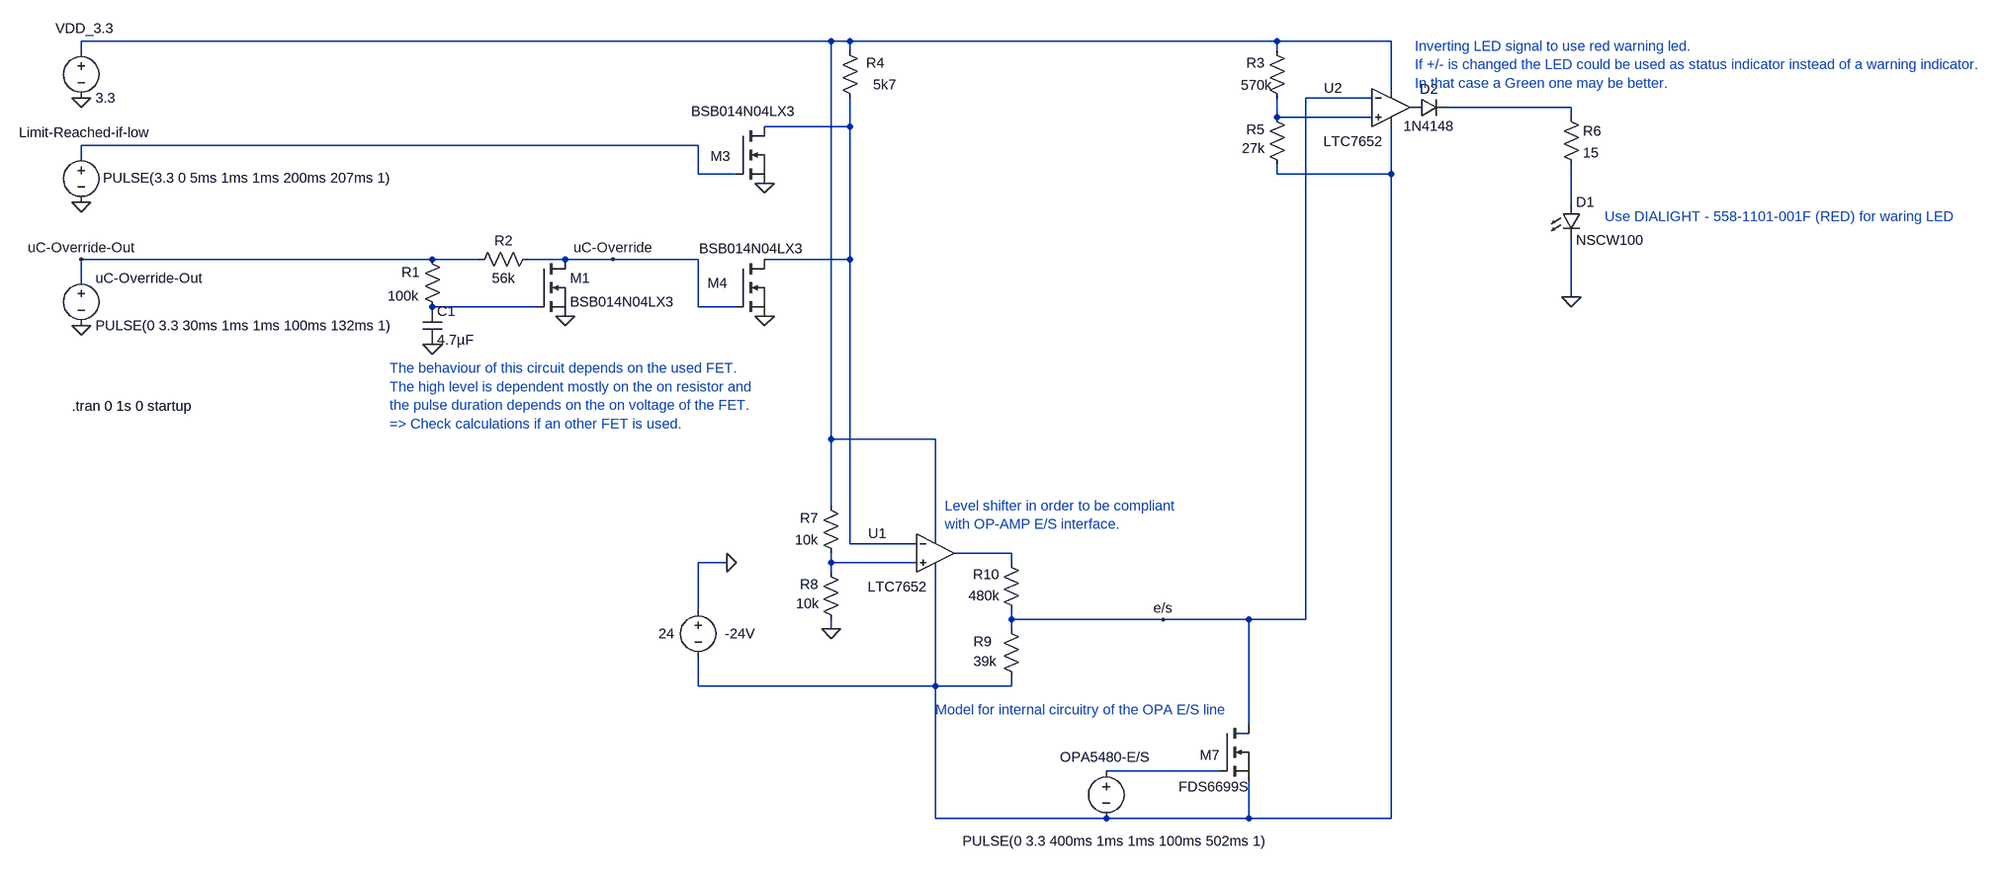
[diagram p0: schematic LimitSwitchOverrider.asc]
LimitSwitchOverrider.asc, the LTspice schematic file:
Version 4
SHEET 1 3236 1280
WIRE 544 -304 -720 -304
WIRE 576 -304 544 -304
WIRE 1296 -304 576 -304
WIRE 1488 -304 1296 -304
WIRE -720 -288 -720 -304
WIRE 576 -288 576 -304
WIRE 1296 -288 1296 -304
WIRE 1488 -224 1488 -304
WIRE 1456 -208 1344 -208
WIRE 1792 -192 1584 -192
WIRE 1296 -176 1296 -208
WIRE 1456 -176 1296 -176
WIRE 1792 -176 1792 -192
WIRE 576 -160 576 -208
WIRE 576 -160 432 -160
WIRE 320 -128 -720 -128
WIRE -720 -112 -720 -128
WIRE 320 -80 320 -128
WIRE 384 -80 320 -80
WIRE 1296 -80 1296 -96
WIRE 1488 -80 1488 -160
WIRE 1488 -80 1296 -80
WIRE 1792 -32 1792 -96
WIRE -128 64 -720 64
WIRE -48 64 -128 64
WIRE 96 64 32 64
WIRE 176 64 96 64
WIRE 320 64 176 64
WIRE 576 64 576 -160
WIRE 576 64 432 64
WIRE -720 96 -720 64
WIRE 1792 128 1792 32
WIRE 48 144 -128 144
WIRE 320 144 320 64
WIRE 384 144 320 144
WIRE 544 368 544 -304
WIRE 720 368 544 368
WIRE 544 480 544 368
WIRE 720 528 720 368
WIRE 576 544 576 64
WIRE 688 544 576 544
WIRE 848 560 752 560
WIRE 368 576 320 576
WIRE 544 576 544 560
WIRE 688 576 544 576
WIRE 848 576 848 560
WIRE 544 592 544 576
WIRE 320 656 320 576
WIRE 848 672 848 656
WIRE 1104 672 848 672
WIRE 1248 672 1104 672
WIRE 1344 672 1344 -208
WIRE 1344 672 1248 672
WIRE 544 688 544 672
WIRE 848 688 848 672
WIRE 320 784 320 736
WIRE 720 784 720 592
WIRE 720 784 320 784
WIRE 848 784 848 768
WIRE 848 784 720 784
WIRE 1248 848 1248 672
WIRE 1200 928 1008 928
WIRE 720 1008 720 784
WIRE 1008 1008 720 1008
WIRE 1248 1008 1248 944
WIRE 1248 1008 1008 1008
WIRE 1488 1008 1488 -80
WIRE 1488 1008 1248 1008
FLAG -128 208 0
FLAG -720 176 0
FLAG 176 64 uC-Override
FLAG -720 64 uC-Override-Out
FLAG -720 -32 0
FLAG -720 -208 0
FLAG 368 576 0
FLAG 544 688 0
FLAG 96 160 0
FLAG 432 -64 0
FLAG 432 160 0
FLAG 1104 672 e/s
FLAG 1792 128 0
SYMBOL res -144 48 R0
WINDOW 0 -36 38 Left 2
WINDOW 3 -59 78 Left 2
SYMATTR InstName R1
SYMATTR Value 100k
SYMBOL voltage -720 80 R0
WINDOW 123 0 0 Left 2
WINDOW 39 0 0 Left 2
SYMATTR InstName uC-Override-Out
SYMATTR Value PULSE(0 3.3 30ms 1ms 1ms 100ms 132ms 1)
SYMBOL cap -144 144 R0
SYMATTR InstName C1
SYMATTR Value 4.7µF
SYMBOL res 48 48 R90
WINDOW 0 0 56 VBottom 2
WINDOW 3 32 56 VTop 2
SYMATTR InstName R2
SYMATTR Value 56k
SYMBOL voltage -720 -128 R0
WINDOW 0 -105 -22 Left 2
WINDOW 3 37 55 Left 2
WINDOW 123 0 0 Left 2
WINDOW 39 0 0 Left 2
SYMATTR InstName Limit-Reached-if-low
SYMATTR Value PULSE(3.3 0 5ms 1ms 1ms 200ms 207ms 1)
SYMBOL voltage -720 -304 R0
WINDOW 0 -43 -22 Left 2
WINDOW 123 0 0 Left 2
WINDOW 39 0 0 Left 2
SYMATTR InstName VDD_3.3
SYMATTR Value 3.3
SYMBOL voltage 320 640 R0
WINDOW 0 45 56 Left 2
WINDOW 3 -67 56 Left 2
WINDOW 123 0 0 Left 2
WINDOW 39 0 0 Left 2
SYMATTR InstName -24V
SYMATTR Value 24
SYMBOL Opamps\\LTC7652 720 496 R0
WINDOW 0 -113 31 Left 2
WINDOW 3 -114 121 Left 2
SYMATTR InstName U1
SYMBOL res 528 464 R0
WINDOW 0 -36 37 Left 2
WINDOW 3 -45 74 Left 2
SYMATTR InstName R7
SYMATTR Value 10k
SYMBOL res 528 576 R0
WINDOW 0 -36 37 Left 2
WINDOW 3 -43 69 Left 2
SYMATTR InstName R8
SYMATTR Value 10k
SYMBOL nmos 384 -160 R0
WINDOW 0 -43 50 Left 2
WINDOW 3 -76 -26 Left 2
SYMATTR InstName M3
SYMATTR Value BSB014N04LX3
SYMBOL res 592 -192 R180
WINDOW 0 -42 75 Left 2
WINDOW 3 -62 39 Left 2
SYMATTR InstName R4
SYMATTR Value 5k7
SYMBOL nmos 384 64 R0
WINDOW 0 -48 40 Left 2
WINDOW 3 -62 -18 Left 2
SYMATTR InstName M4
SYMATTR Value BSB014N04LX3
SYMBOL res 832 672 R0
WINDOW 0 -48 37 Left 2
WINDOW 3 -48 71 Left 2
SYMATTR InstName R9
SYMATTR Value 39k
SYMBOL res 864 672 R180
WINDOW 0 36 76 Left 2
WINDOW 3 36 40 Left 2
SYMATTR InstName R10
SYMATTR Value 480k
SYMBOL voltage 1008 912 R0
WINDOW 0 -78 -8 Left 2
WINDOW 3 -242 134 Left 2
WINDOW 123 0 0 Left 2
WINDOW 39 0 0 Left 2
SYMATTR InstName OPA5480-E/S
SYMATTR Value PULSE(0 3.3 400ms 1ms 1ms 100ms 502ms 1)
SYMBOL nmos 1200 848 R0
WINDOW 0 -34 53 Left 2
WINDOW 3 -70 106 Left 2
SYMATTR InstName M7
SYMATTR Value FDS6699S
SYMBOL nmos 48 64 R0
SYMATTR InstName M1
SYMATTR Value BSB014N04LX3
SYMBOL Opamps\\LTC7652 1488 -256 R0
WINDOW 0 -113 31 Left 2
WINDOW 3 -114 121 Left 2
SYMATTR InstName U2
SYMBOL res 1280 -304 R0
WINDOW 0 -36 37 Left 2
WINDOW 3 -45 74 Left 2
SYMATTR InstName R3
SYMATTR Value 570k
SYMBOL res 1280 -192 R0
WINDOW 0 -36 37 Left 2
WINDOW 3 -43 69 Left 2
SYMATTR InstName R5
SYMATTR Value 27k
SYMBOL res 1776 -192 R0
SYMATTR InstName R6
SYMATTR Value 15
SYMBOL diode 1520 -176 R270
WINDOW 0 32 32 VTop 2
WINDOW 3 0 32 VBottom 2
SYMATTR InstName D2
SYMATTR Value 1N4148
SYMBOL LED 1776 -32 R0
SYMATTR InstName D1
SYMATTR Value NSCW100
TEXT -736 312 Left 2 !.tran 0 1s 0 startup
TEXT -200 248 Left 2 ;The behaviour of this circuit depends on the used FET.\nThe high level is dependent mostly on the on resistor and \nthe pulse duration depends on the on voltage of the FET.\n=> Check calculations if an other FET is used.
TEXT 720 824 Left 2 ;Model for internal circuitry of the OPA E/S line
TEXT 1528 -296 Left 2 ;Inverting LED signal to use red warning led.\nIf +/- is changed the LED could be used as status indicator instead of a warning indicator.\nIn that case a Green one may be better.
TEXT 736 480 Left 2 ;Level shifter in order to be compliant\nwith OP-AMP E/S interface.
TEXT 1848 -8 Left 2 ;Use DIALIGHT - 558-1101-001F (RED) for waring LED

The netlist it stands for:
* LimitSwitchOverrider.asc
R1 uC-Override-Out N008 100k
V§uC-Override-Out uC-Override-Out 0 PULSE(0 3.3 30ms 1ms 1ms 100ms 132ms 1)
C1 N008 0 4.7µF
R2 uC-Override uC-Override-Out 56k
V§Limit-Reached-if-low N005 0 PULSE(3.3 0 5ms 1ms 1ms 200ms 207ms 1)
VDD_3.3 N001 0 3.3
V§-24V 0 N006 24
XU1 N010 N004 N001 N006 N009 LTC1052  ; LTC7652, pins In+ In- V+ V- OUT
R7 N001 N010 10k
R8 N010 0 10k
M3 N004 N005 0 0 BSB014N04LX3
R4 N004 N001 5k7
M4 N004 uC-Override 0 0 BSB014N04LX3
R9 e/s N006 39k
R10 e/s N009 480k
V§OPA5480-E/S N011 N006 PULSE(0 3.3 400ms 1ms 1ms 100ms 502ms 1)
M7 e/s N011 N006 N006 FDS6699S
M1 uC-Override N008 0 0 BSB014N04LX3
XU2 N003 e/s N001 N006 P001 LTC1052  ; LTC7652, pins In+ In- V+ V- OUT
R3 N001 N003 570k
R5 N003 N006 27k
R6 N002 N007 15
D2 P001 N002 1N4148
D1 N007 0 NSCW100
.model D D
.lib standard.dio
.model NMOS NMOS
.model PMOS PMOS
.lib standard.mos
.tran 0 1s 0 startup
* The behaviour of this circuit depends on the used FET.
* The high level is dependent mostly on the on resistor and
* the pulse duration depends on the on voltage of the FET.
* => Check calculations if an other FET is used.
* Model for internal circuitry of the OPA E/S line
* Inverting LED signal to use red warning led.
* If +/- is changed the LED could be used as status indicator instead of a warning indicator.
* In that case a Green one may be better.
* Level shifter in order to be compliant
* with OP-AMP E/S interface.
* Use DIALIGHT - 558-1101-001F (RED) for waring LED
.backanno
.end